# EAGLE design starboard (EAGLE 9.4.2)
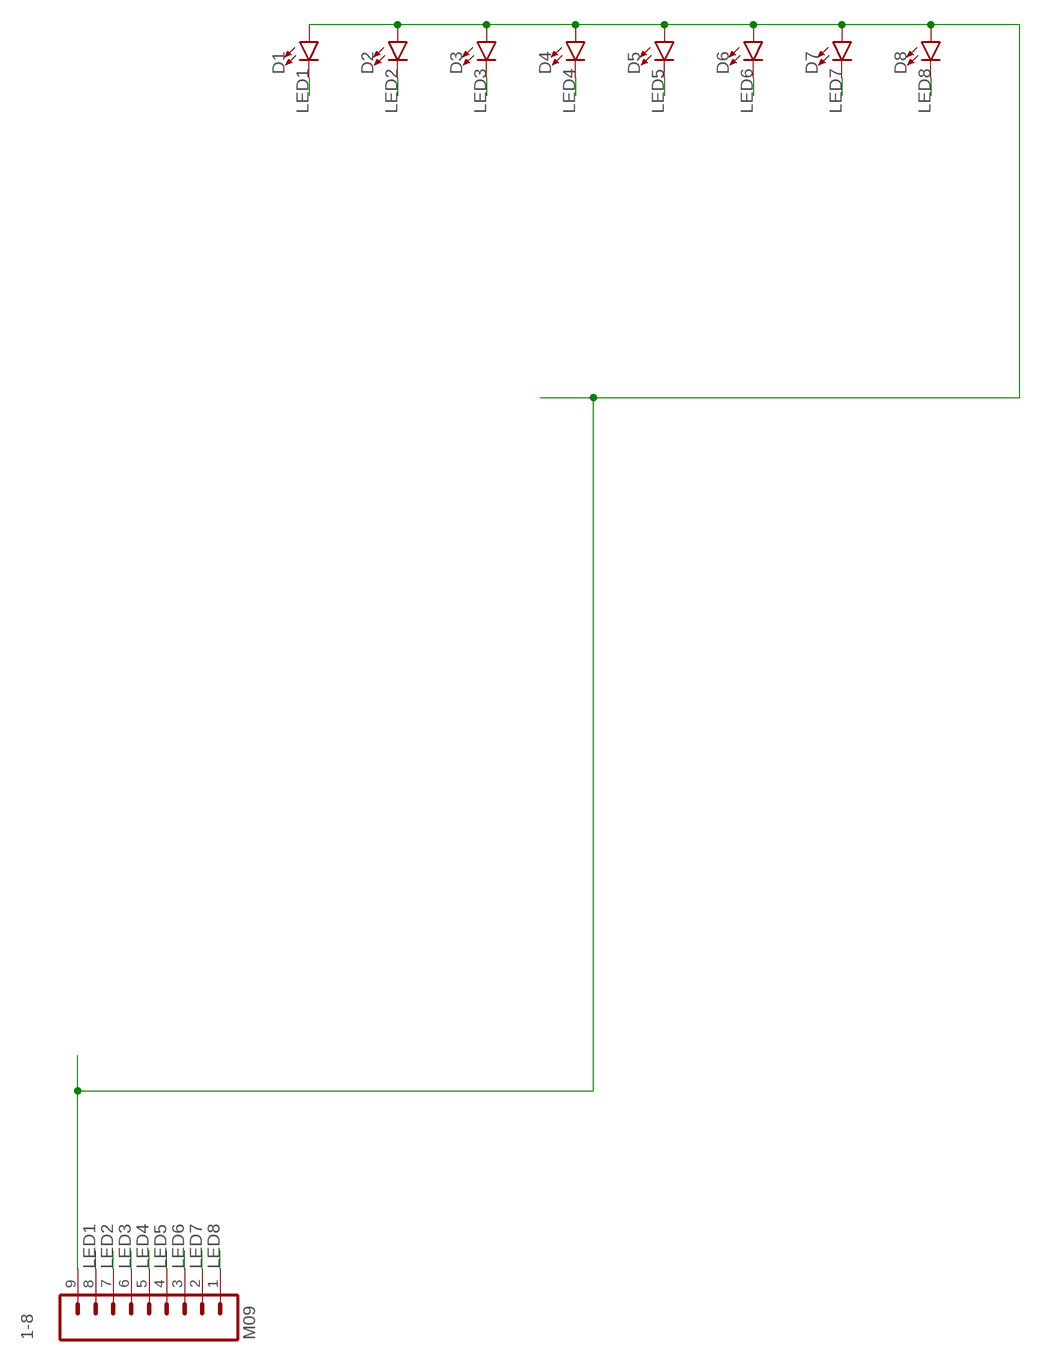
[diagram p0: schematic, sheet 1]

## Parts
1-8  M09  [1X09]
D1  LED5MM  [LED_5MM]
D2  LED5MM  [LED_5MM]
D3  LED5MM  [LED_5MM]
D4  LED5MM  [LED_5MM]
D5  LED5MM  [LED_5MM]
D6  LED5MM  [LED_5MM]
D7  LED5MM  [LED_5MM]
D8  LED5MM  [LED_5MM]

## Nets
LED1: 1-8.8 D1.K(C)
LED2: 1-8.7 D2.K(C)
LED3: 1-8.6 D3.K(C)
LED4: 1-8.5 D4.K(C)
LED5: 1-8.4 D5.K(C)
LED6: 1-8.3 D6.K(C)
LED7: 1-8.2 D7.K(C)
LED8: 1-8.1 D8.K(C)
LED+: 1-8.9 D1.A D2.A D3.A D4.A D5.A D6.A D7.A D8.A

## Library data of the parts
1-8 = SparkFun:M09: Header 9 Standard 9-pin 0.1" header. Use with straight break away headers (SKU : PRT-00116), right angle break away headers (PRT-00553), swiss pins (PRT-00743), machine pins (PRT-00117), and female headers (PRT-00115).
D1-D8 = SparkFun-LED:LED: LED (Generic) Standard schematic elements and footprints for 5mm, 3mm, 1206, and 0603 sized LEDs. Generic LEDs with no color specified.

## Net classes
0 everything: width 0.254 mm

## Board
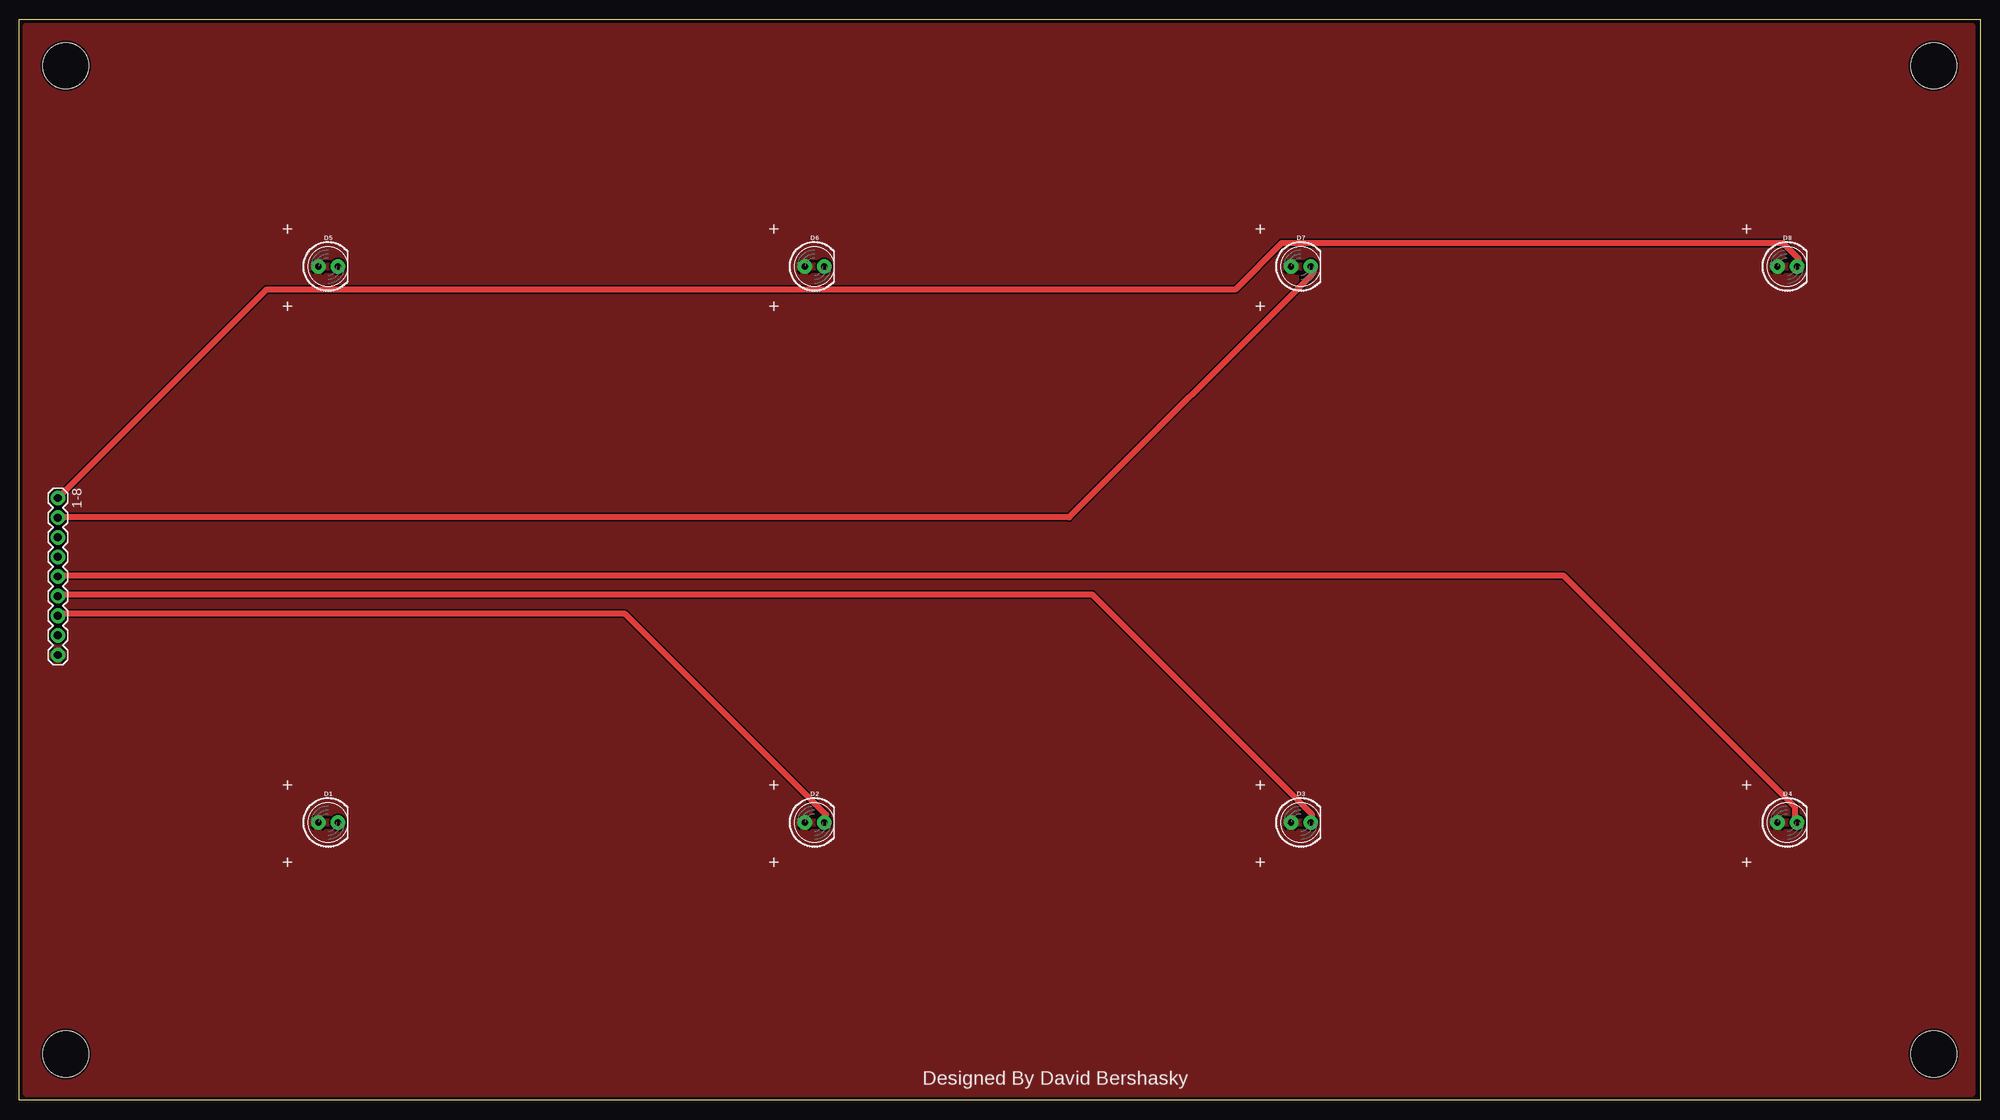
[diagram p1: board, top side]
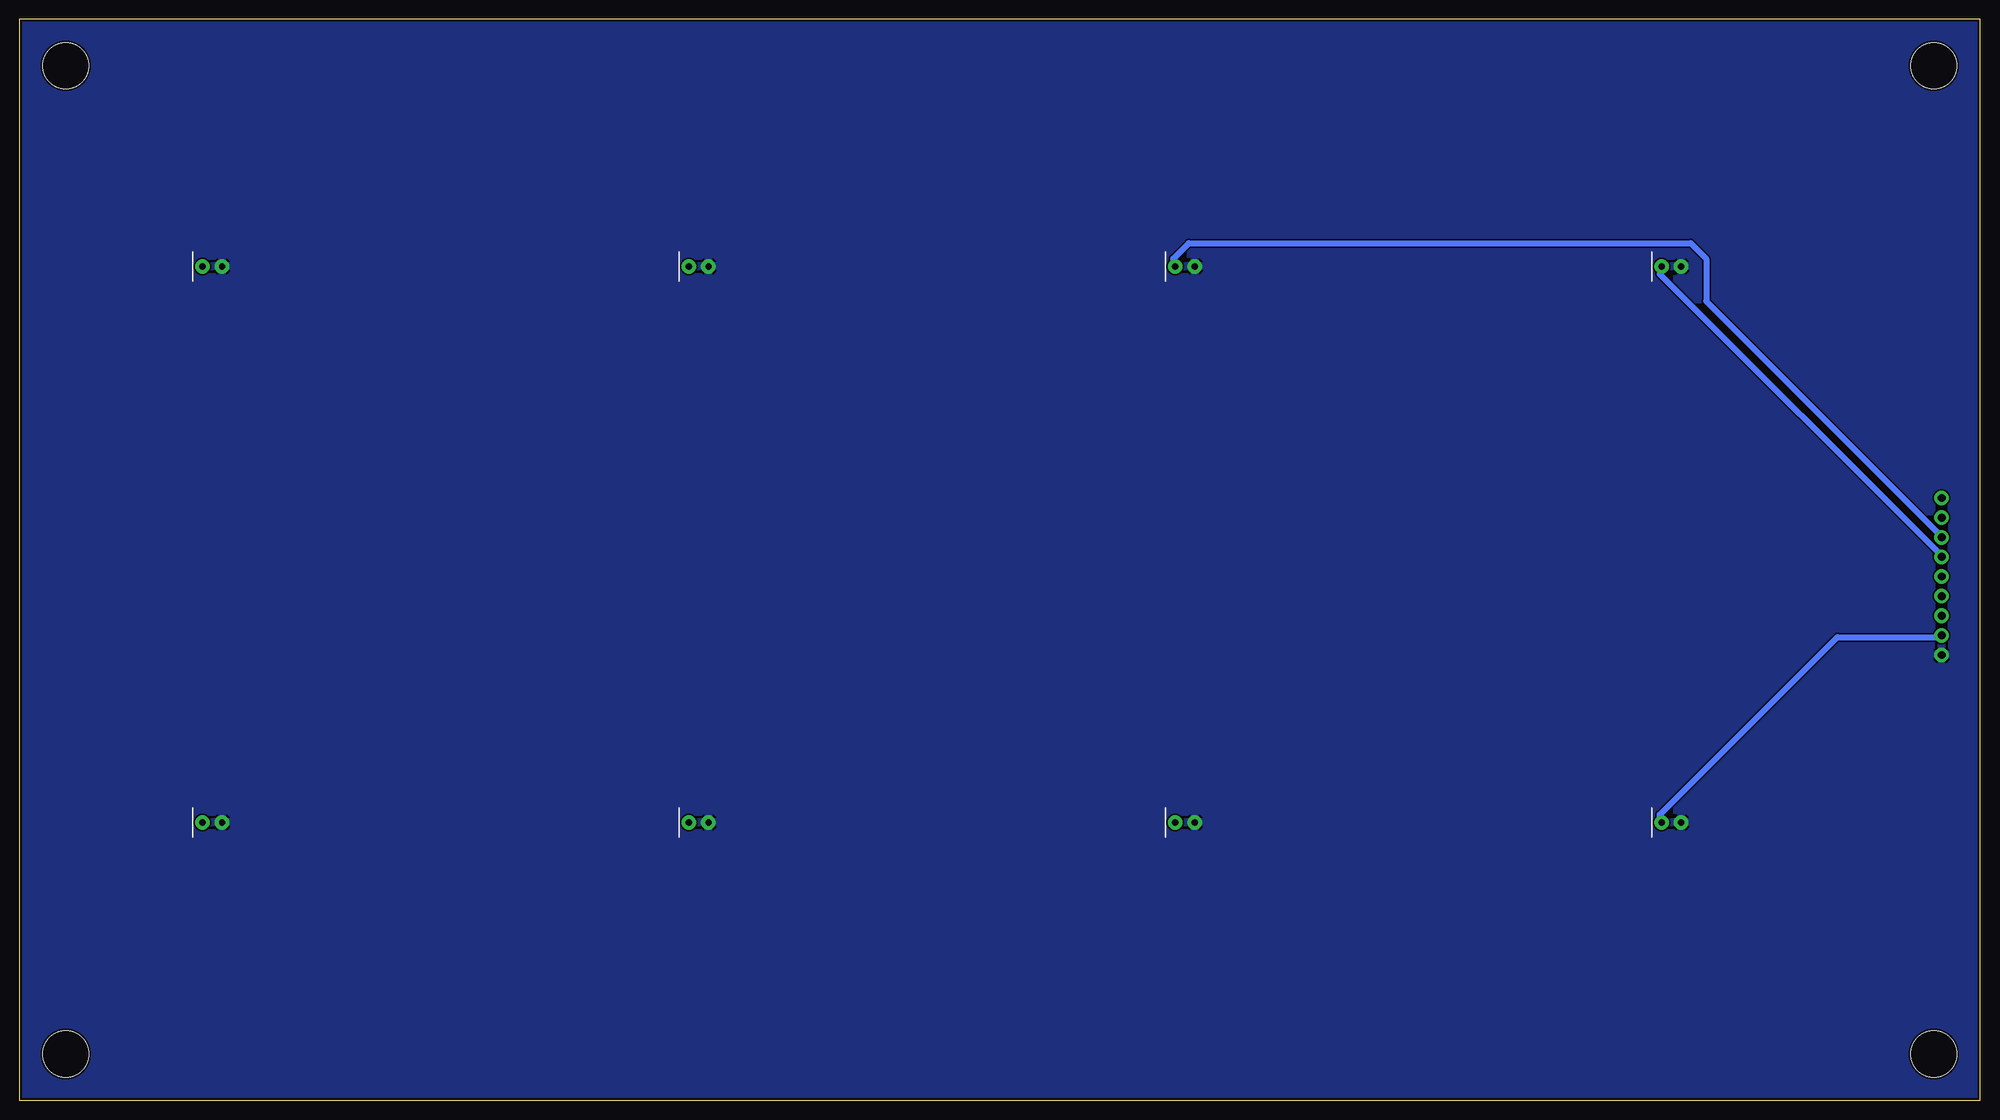
[diagram p2: board, bottom side, seen from below]

Size 254 x 140 mm. Coordinates in mm from the lower left corner, seen from the top.
Outline: 0,0 0,140 254,140 254,0 0,0
Copper layers (1*16): Top 0.035mm / dielectric 1.5mm / Bottom 0.035mm
Design rules "adafruit *": minimum track width 30mil, minimum drill 15.5mil, track to track 8mil, track to pad 8mil, pad to pad 8mil, via to via 8mil, smd to smd 8mil, copper to edge 10mil, drill to drill 8mil, minimum pad ring 10mil, minimum via ring 8mil, stop-mask expansion 4mil, vias tented up to drill 20mil, thermal gap 10mil
Holes 6 mm at 6,134 248,134 6,6 248,6

### Footprints (pad centres in the part's own frame; a part is rotated, then mirrored left to right if it is on the bottom)
1X09 = drill 1.016 pad 1.88: 1 0,0; 2 2.54,0; 3 5.08,0; 4 7.62,0; 5 10.16,0; 6 12.7,0; 7 15.24,0; 8 17.78,0; 9 20.32,0
LED_5MM = drill 0.813 pad 1.88: A -1.27,0; K 1.27,0

### Placement (x,y rotation side)
1-8  5,78 270 top
D1  40,36 0 top
D2  103,36 0 top
D3  166,36 0 top
D4  229,36 0 top
D5  40,108 0 top
D6  103,108 0 top
D7  166,108 0 top
D8  229,108 0 top

### Tracks (layer width: path | path; a pad name or v marks a point on that pad's centre or on a via)
LED1
  Bottom 0.762: 1-8.8 5,60 18.5,60 41.5,37 41.5,36 D1.K
LED2
  Top 0.762: 1-8.7 5,63 78.5,63 104.5,37 104.5,36 D2.K
LED3
  Top 0.762: 1-8.6 5,65.5 139,65.5 167.5,37 167.5,36 D3.K
LED4
  Top 0.762: D4.K 230,36 230,38 200,68 5,68 1-8.5
LED5
  Bottom 0.762: 1-8.4 5,70.5 41.5,107 41.5,108 D5.K
LED6
  Bottom 0.762: 1-8.3 5,73 35.5,103.5 35.5,109 37.5,111 102.5,111 104.5,109 104.5,108 D6.K
LED7
  Top 0.762: 1-8.2 5,75.5 136,75.5 167.5,107 167.5,108 D7.K
LED8
  Top 0.762: 1-8.1 32,105 157.5,105 163.5,111 228.5,111 230.5,109 230.5,108 D8.K
LED+
  pour Top: 0.95,139.05 252.86,139.05 252.86,0.95 0.95,0.95
  pour Bottom: 0,139.7 254,139.7 254,0 0,0

### Text on the board
tNames: + | + | + | + | + | + | + | + | + | + | + | + | + | + | + | Designed By David Bershasky